# EAGLE design Engine Room (EAGLE 6.2)
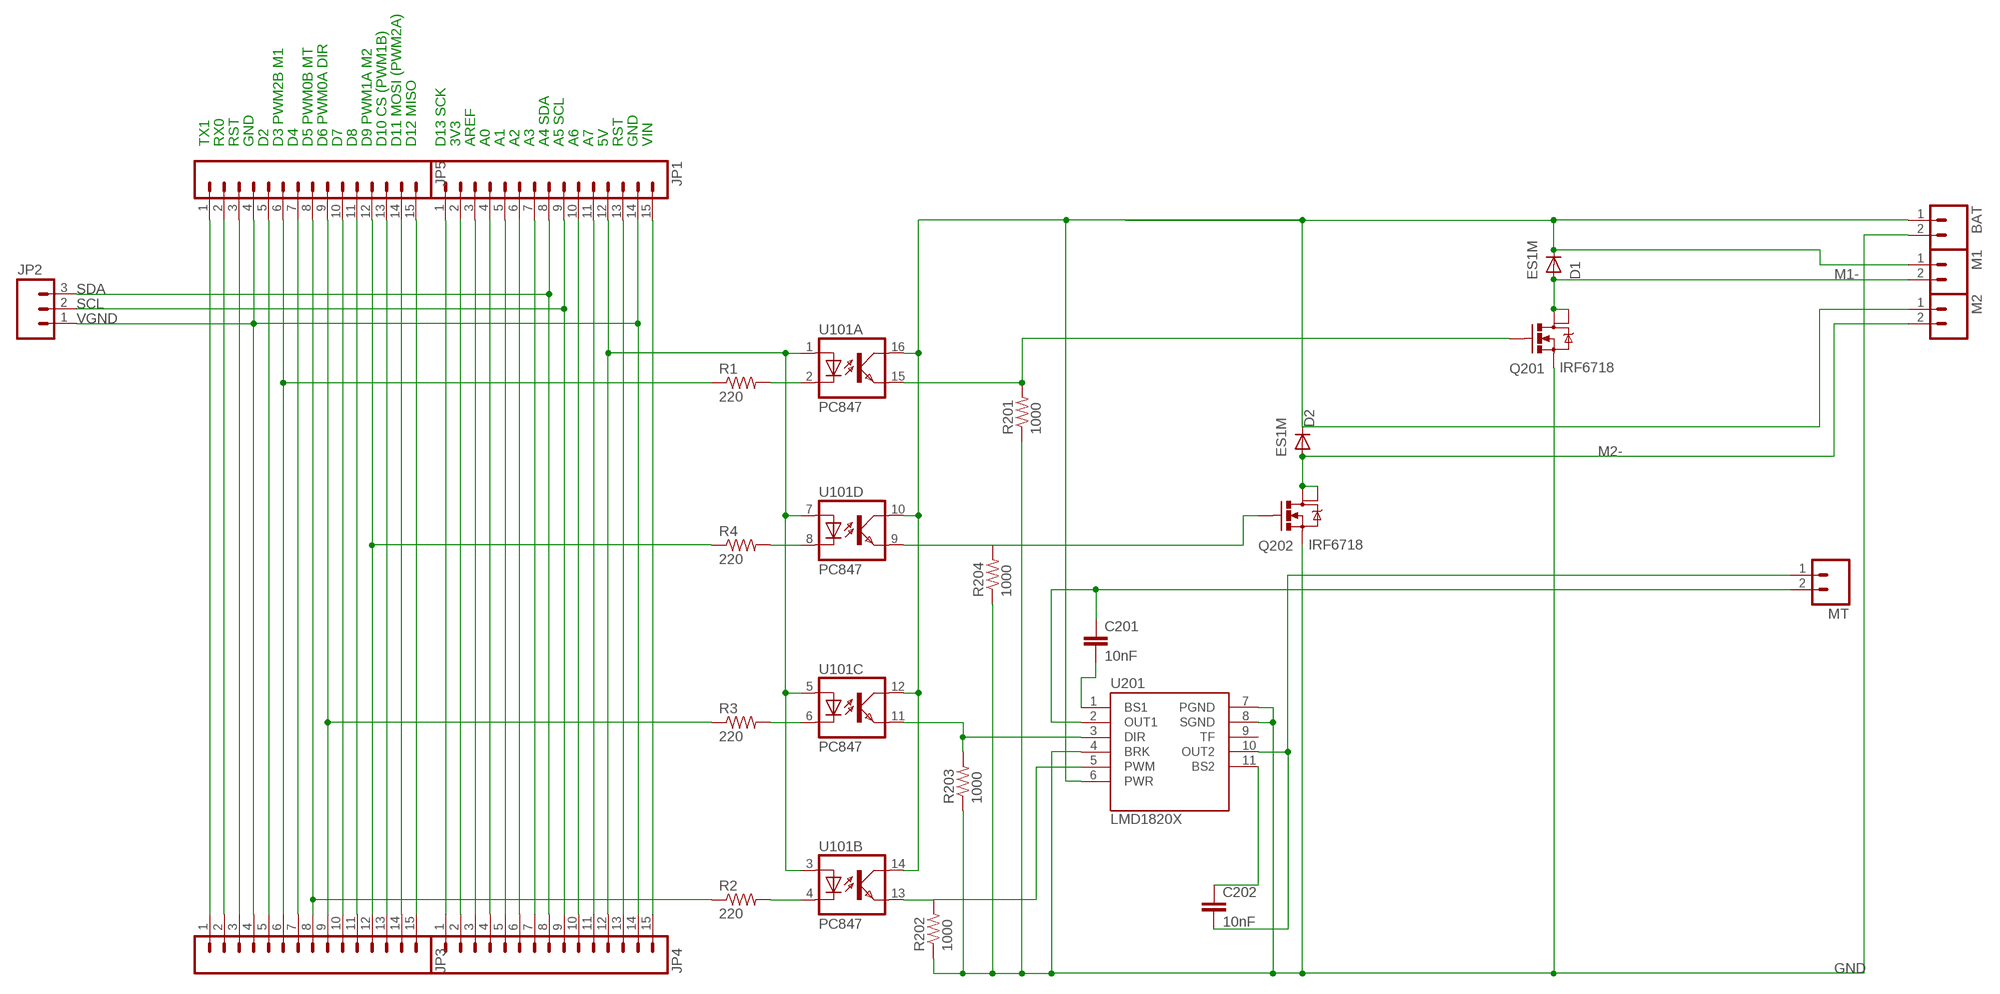
[diagram p0: schematic, sheet 1]

## Parts
BAT  M02PTH4  [1X02_XTRA_BIG]
C201  10nF  CAP0402-CAP  [0402-CAP]
C202  10nF  CAP0402-CAP  [0402-CAP]
D1  ES1M  DIODE-DO-214AC  [DO-214AC]
D2  ES1M  DIODE-DO-214AC  [DO-214AC]
JP1  M15LOCK  [1X15_LOCK]
JP2  M03LOCK  [1X03_LOCK]
JP3  M15  [1X15]
JP4  M15  [1X15]
JP5  M15LOCK  [1X15_LOCK]
M1  M02PTH4  [1X02_XTRA_BIG]
M2  M02PTH4  [1X02_XTRA_BIG]
MT  M02PTH  [1X02]
Q201  IRF6718  [DIRECTFET_L6]
Q202  IRF6718  [DIRECTFET_L6]
R1  220  RESISTOR0402-RES  [0402-RES]
R2  220  RESISTOR0402-RES  [0402-RES]
R3  220  RESISTOR0402-RES  [0402-RES]
R4  220  RESISTOR0402-RES  [0402-RES]
R201  1000  RESISTOR0402-RES  [0402-RES]
R202  1000  RESISTOR0402-RES  [0402-RES]
R203  1000  RESISTOR0402-RES  [0402-RES]
R204  1000  RESISTOR0402-RES  [0402-RES]
U101  PC847  [DIL16]
U201  LMD1820X  [TO-220-11LEAD]

## Nets
GND [power]: BAT.2 Q201.S Q202.S R201.1 R202.1 R203.1 R204.1 U201.4(BRK) U201.7(PGND) U201.8(SGND)
IN1: JP3.6 JP5.6 R1.1
IN2: JP3.12 JP5.12 R4.1
IN3: JP3.8 JP5.8 R2.1
M1- [power]: D1.A M1.2 Q201.D1 Q201.D2
M2- [power]: D2.A M2.2 Q202.D1 Q202.D2
N$1: R4.2 U101.8(D:C)
N$2: R3.2 U101.6(C:C)
N$3: R1.2 U101.2(A:C)
N$4: R2.2 U101.4(B:C)
N$5: JP1.15 JP4.15
N$6: Q201.G R201.2 U101.15(A:EMIT)
N$7: C202.1 U201.11(BS2)
N$8: Q202.G R204.2 U101.9(D:EMIT)
N$9: C201.2 U201.1(BS1)
N$10: R203.2 U101.11(C:EMIT) U201.3(DIR)
N$11: JP3.9 JP5.9 R3.1
N$12: JP3.1 JP5.1
N$13: JP3.2 JP5.2
N$14: JP3.3 JP5.3
N$15: R202.2 U101.13(B:EMIT) U201.5(PWM)
N$16 [lt_power]: C201.1 MT.2 U201.2(OUT1)
N$17 [lt_power]: C202.2 MT.1 U201.10(OUT2)
N$18: JP3.5 JP5.5
N$19: JP3.15 JP5.15
N$20: JP3.14 JP5.14
N$21: JP3.13 JP5.13
N$22: JP3.7 JP5.7
N$23: JP3.10 JP5.10
N$24: JP3.11 JP5.11
N$25: JP1.13 JP4.13
N$26: JP1.11 JP4.11
N$27: JP1.10 JP4.10
N$28: JP1.7 JP4.7
N$29: JP1.6 JP4.6
N$30: JP1.5 JP4.5
N$31: JP1.4 JP4.4
N$32: JP1.3 JP4.3
N$33: JP1.2 JP4.2
N$34: JP1.1 JP4.1
SCL: JP1.9 JP2.2 JP4.9
SDA: JP1.8 JP2.3 JP4.8
VCC: JP1.12 JP4.12 U101.1(A:A) U101.3(B:A) U101.5(C:A) U101.7(D:A)
VDD [power]: BAT.1 D1.C D2.C M1.1 M2.1 U101.10(D:COL) U101.12(C:COL) U101.14(B:COL) U101.16(A:COL) U201.6(PWR)
VGND: JP1.14 JP2.1 JP3.4 JP4.14 JP5.4
Unconnected: U201.9(TF)

## Notes on the sheet
- TX1 | RX0 | RST | GND | D2 | D3 PWM2B M1 | D4 | D5 PWM0B MT | D6 PWM0A DIR | D7 | D8 | D9 PWM1A M2 | D10 CS (PWM1B) | D11 MOSI (PWM2A) | D12 MISO | D13 SCK | 3V3 | AREF | A0 | A1 | A2 | A3 | A4 SDA | A5 SCL | A6 | A7 | 5V | RST | GND | VIN

## Library data of the parts
BAT M1 M2 MT = SparkFun:M02: Header 2 Standard 2-pin 0.1" header. Use with straight break away headers (SKU : PRT-00116), right angle break away headers (PRT-00553), swiss pins (PRT-00743), machine pins (PRT-00117), and female headers (PRT-00115). Molex polarized connector foot print use with SKU : PRT-08233 with associated crimp pins and housings.
C201 C202 = SparkFun:CAP: Capacitor Standard 0603 ceramic capacitor, and 0.1" leaded capacitor.
D1 D2 = diode:DIODE-: DIODE
JP1 JP3-JP5 = SparkFun:M15: Header 15 Standard 15-pin 0.1" header. Use with straight break away headers (SKU : PRT-00116), right angle break away headers (PRT-00553), swiss pins (PRT-00743), machine pins (PRT-00117), and female headers (PRT-00115).
JP2 = SparkFun:M03: Header 3 Standard 3-pin 0.1" header. Use with straight break away headers (SKU : PRT-00116), right angle break away headers (PRT-00553), swiss pins (PRT-00743), machine pins (PRT-00117), and female headers (PRT-00115). Molex polarized connector foot print use with SKU : PRT-08232 with associated crimp pins and housings.
Q201 Q202 = KwanSystems:IRF6718
R1-R4 R201-R204 = SparkFun:RESISTOR: Resistor Basic schematic elements and footprints for 0603, 1206, and PTH resistors.
U101 = optocoupler:PC847: SHARP OPTO COUPLER
U201 = SparkFun:LMD1820X: LMD1820X H-Bridge - BOB-00747

## Net classes
0 default: width 0.254 mm, clearance 0.254 mm
1 power: width 1.524 mm, clearance 0.254 mm
2 lt_power: width 0.254 mm, clearance 0.254 mm

## Board
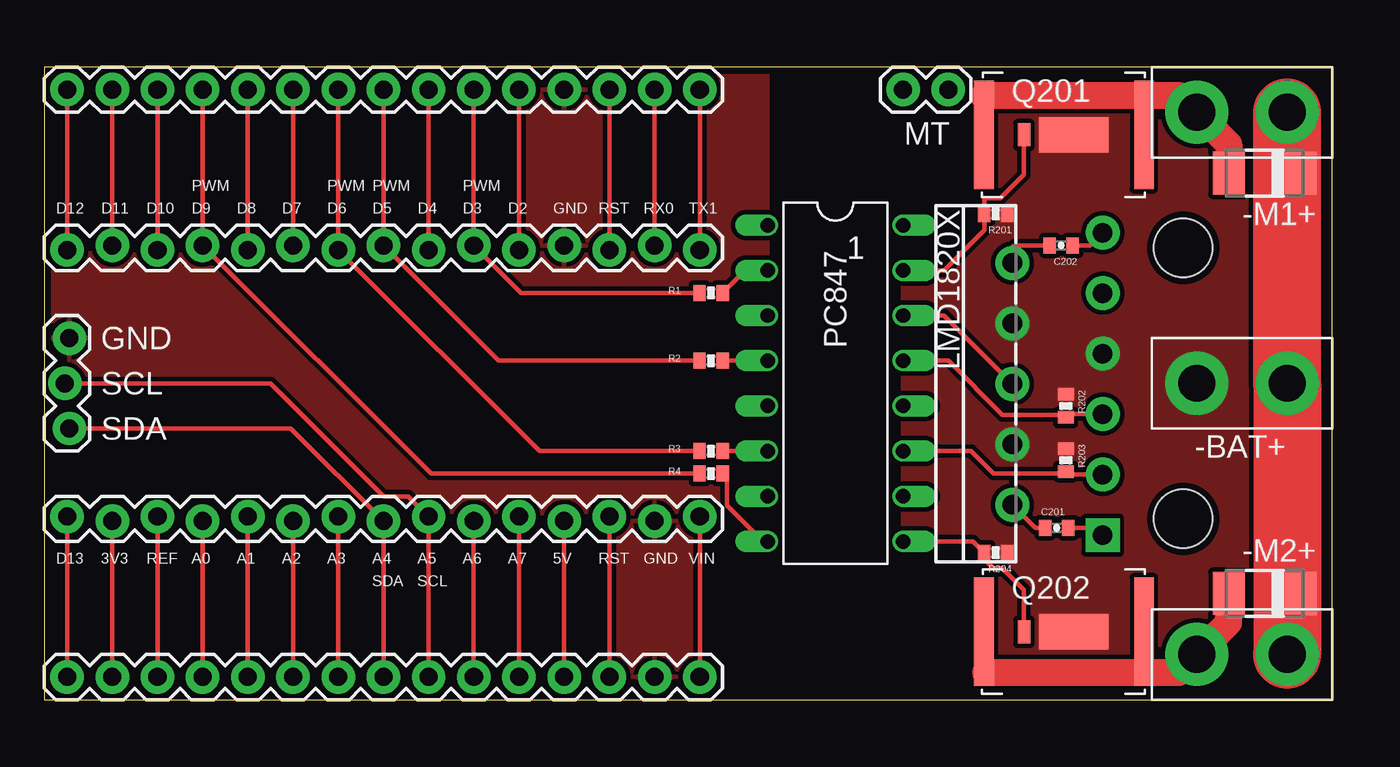
[diagram p1: board, top side]
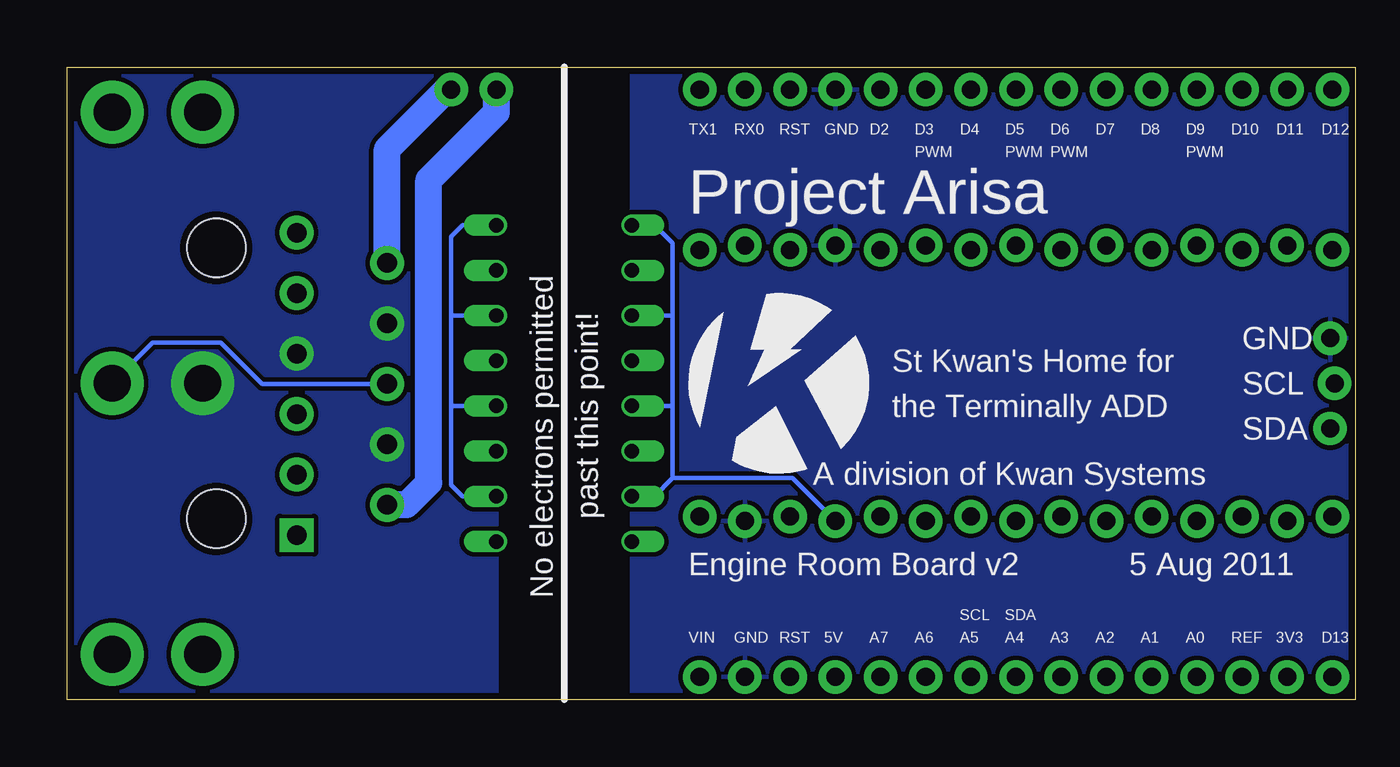
[diagram p2: board, bottom side, seen from below]

Size 72.39 x 35.56 mm. Coordinates in mm from the lower left corner, seen from the top.
Outline: 0,0 72.39,0 72.39,35.56 0,35.56 0,0
Copper layers (1*16): Top 0.0356mm / dielectric 1.5011mm / Bottom 0.0356mm
Design rules: minimum track width 6mil, minimum drill 13mil, track to track 6mil, track to pad 6mil, pad to pad 6mil, via to via 6mil, smd to smd 6mil, copper to edge 15mil, drill to drill 6mil, minimum pad ring 7mil, minimum via ring 7mil, stop-mask expansion 4mil, vias tented up to drill 0mil, thermal gap 10mil
tRestrict: area 41.9,0 to 47,35.6
bRestrict: area 41.9,0 to 47,35.6
vRestrict: area 29.8,15.2 to 34.9,20.3; area 0,26.7 to 38.1,33; area 7,15.9 to 26,19.7; area 2.5,12.1 to 30.5,13.3; area 0,2.5 to 38.1,8.9

### Footprints (pad centres in the part's own frame; a part is rotated, then mirrored left to right if it is on the bottom)
1X02_XTRA_BIG = drill 2.057 pad 3.556: 1 -2.54,0; 2 2.54,0
0402-CAP = smd 0.7 x 0.9: 1 -0.65,0; 2 0.65,0
DO-214AC = smd 1.8 x 2.4: A 2.025,0; C -2.025,0
1X15_LOCK = drill 1.016 pad 1.88: 1 0,0.127; 2 2.54,-0.127; 3 5.08,0.127; 4 7.62,-0.127; 5 10.16,0.127; 6 12.7,-0.127; 7 15.24,0.127; 8 17.78,-0.127; 9 20.32,0.127; 10 22.86,-0.127; 11 25.4,0.127; 12 27.94,-0.127; 13 30.48,0.127; 14 33.02,-0.127; 15 35.56,0.127
1X03_LOCK = drill 1.016 pad 1.88: 1 0,0.127; 2 2.54,-0.127; 3 5.08,0.127
1X15 = drill 1.016 pad 1.88: 1 0,0; 2 2.54,0; 3 5.08,0; 4 7.62,0; 5 10.16,0; 6 12.7,0; 7 15.24,0; 8 17.78,0; 9 20.32,0; 10 22.86,0; 11 25.4,0; 12 27.94,0; 13 30.48,0; 14 33.02,0; 15 35.56,0
1X02 = drill 1.016 pad 1.88: 1 0,0; 2 2.54,0
DIRECTFET_L6 = smd 1.1 x 6.1: D1 -4.35,0; D2 4.65,0 | smd 0.7 x 1.3: G -2.1,0 | smd 3.9 x 2: S 0.7,0
0402-RES = smd 0.7 x 0.9: 1 -0.65,0; 2 0.65,0
DIL16 = drill 0.813 offset: 1 -8.89,-3.81; 2 -6.35,-3.81; 3 -3.81,-3.81; 4 -1.27,-3.81; 5 1.27,-3.81; 6 3.81,-3.81; 7 6.35,-3.81; 8 8.89,-3.81; 9 8.89,3.81; 10 6.35,3.81; 11 3.81,3.81; 12 1.27,3.81; 13 -1.27,3.81; 14 -3.81,3.81; 15 -6.35,3.81; 16 -8.89,3.81
TO-220-11LEAD = drill 1.1 pad 1.9 square: 1 1.5,-4.87 | drill 1.1 pad 1.9: 2 3.2,0.21; 3 4.9,-4.87; 4 6.6,0.21; 5 8.3,-4.87; 6 10,0.21; 7 11.7,-4.87; 8 13.4,0.21; 9 15.1,-4.87; 10 16.8,0.21; 11 18.5,-4.87
STAND-OFF = hole 3.302: 0,0

### Placement (x,y rotation side)
BAT  67.31,17.78 180 top
C201  56.9,9.65 0 top
C202  57.15,25.53 180 top
D1  68.58,29.59 180 top
D2  68.58,5.97 180 top
JP1  1.27,10.16 0 top
JP2  1.27,20.32 270 top
JP3  36.83,34.29 180 top
JP4  1.27,1.27 0 top
JP5  36.83,25.4 180 top
M1  67.31,33.02 180 top
M2  67.31,2.54 180 top
MT  50.8,34.29 180 top
Q201  57.15,31.75 0 top
Q202  57.15,3.81 0 top
R1  37.47,22.86 0 top
R2  37.47,19.05 0 top
R3  37.47,13.97 0 top
R4  37.47,12.7 0 top
R201  53.47,27.3 180 top
R202  57.4,16.51 270 top
R203  57.4,13.46 270 top
R204  53.47,8.26 180 top
U101  44.45,17.78 270 top
U201  54.61,7.75 90 top
U$1  [STAND-OFF]  64.01,10.16 0 top
U$2  [STAND-OFF]  64.01,25.4 0 top
U$3  [KWAN_CIRCLE]  32.38,17.78 0 bottom

### Tracks (layer width: path | path; a pad name or v marks a point on that pad's centre or on a via)
GND
  pour Top (no thermals): 48.26,35.56 72.39,35.56 72.39,0 48.26,0
  pour Bottom (no thermals): 48.26,35.56 72.39,35.56 72.39,0 48.26,0
IN1
  Top 0.254: R1.1 26.8,22.86 JP5.6 JP3.6
IN2
  Top 0.254: JP3.12 JP5.12 21.72,12.7 R4.1
IN3
  Top 0.254: JP3.8 JP5.8 25.53,19.05 R2.1
M1-
  Top 0.254: 52.8,33.95 Q201.D1 | Q201.D2 61.72,31.75 61.72,33.95
  Top 1.524: D1.A 66.56,31.23 M1.2 63.84,33.95 61.72,33.95 52.8,33.95
M2-
  Top 0.406: Q202.D1 53.09,3.81 53.09,1.52 | Q202.D2 61.89,3.81 61.89,1.61
  Top 1.524: 61.98,1.52 63.75,1.52 M2.2 66.56,4.33 D2.A | 61.98,1.52 61.89,1.61 | 52.89,1.52 53.09,1.52 61.98,1.52
N$1
  Top 0.254: R4.2 38.35,12.46 38.35,10.92 40.39,8.89 U101.8
N$2
  Top 0.254: R3.2 U101.6
N$3
  Top 0.254: R1.2 39.38,24.13 U101.2
N$4
  Top 0.254: R2.2 U101.4
N$5
  Top 0.254: JP4.15 JP1.15
N$6
  Top 0.254: U101.15 50.55,24.13 52.82,26.4 R201.2 52.83,27.32 52.83,28.19 53.74,28.19 55.05,29.51 Q201.G
N$7
  Top 0.254: C202.1 58.76,25.53 U201.11
N$8
  Top 0.254: U101.9 52.18,8.89 R204.2 52.82,7.89 53.34,7.37 53.85,7.37 55.05,6.16 Q202.G
N$9
  Top 0.254: C201.2 59.08,9.65 U201.1
N$10
  Top 0.254: U201.3 57.57,12.65 R203.2 57.29,12.7 53.34,12.7 52.07,13.97 U101.11
N$11
  Top 0.254: JP3.9 JP5.9 27.81,13.97 R3.1
N$12
  Top 0.254: JP5.1 JP3.1
N$13
  Top 0.254: JP5.2 JP3.2
N$14
  Top 0.254: JP5.3 JP3.3
N$15
  Top 0.254: 58.83,16.05 U201.5 57.59,16.05 R202.2 57.26,16 53.85,16 50.8,19.05 U101.13
N$16
  Top 0.254: C201.1 55.7,9.65 U201.2
  Bottom 1.524: U201.2 53.31,10.95 52.07,12.19 52.07,29.21 48.26,33.02 MT.2
N$17
  Top 0.254: C202.2 54.53,25.53 54.4,25.4 U201.10
  Bottom 1.524: U201.10 54.4,30.94 51.05,34.29 MT.1
N$18
  Top 0.254: JP5.5 JP3.5
N$19
  Top 0.254: JP5.15 JP3.15
N$20
  Top 0.254: JP5.14 JP3.14
N$21
  Top 0.254: JP5.13 JP3.13
N$22
  Top 0.254: JP5.7 JP3.7
N$23
  Top 0.254: JP5.10 JP3.10
N$24
  Top 0.254: JP5.11 JP3.11
N$25
  Top 0.254: JP4.13 JP1.13
N$26
  Top 0.254: JP4.11 JP1.11
N$27
  Top 0.254: JP4.10 JP1.10
N$28
  Top 0.254: JP4.7 JP1.7
N$29
  Top 0.254: JP4.6 JP1.6
N$30
  Top 0.254: JP4.5 JP1.5
N$31
  Top 0.254: JP4.4 JP1.4
N$32
  Top 0.254: JP4.3 JP1.3
N$33
  Top 0.254: JP4.2 JP1.2
N$34
  Top 0.254: JP4.1 JP1.1
SCL
  Top 0.254: 21.59,1.02 JP4.9 JP1.9 20.45,11.43 19.05,11.43 12.7,17.78 JP2.2
SDA
  Top 0.254: JP4.8 JP1.8 13.84,15.24 13.72,15.24 12.95,15.24 JP2.3
VCC
  Top 0.254: JP4.12 JP1.12
  Bottom 0.254: U101.1 39.37,26.67 38.35,25.65 38.35,21.59 | 38.35,12.45 38.35,16.51 | 38.35,16.51 38.35,21.59 | 38.35,12.45 39.37,11.43 U101.7 | 38.35,16.51 U101.5 | JP1.12 31.62,12.45 38.35,12.45 | 38.35,21.59 U101.3
VDD
  Top 0.254: U201.6 50.56,21.59 U101.14
  Top 1.524: M2.1 arc-90 69.34,3.05 69.34,6.35 | 69.34,6.35 arc-90 69.33,6.36 | 69.46,29.72 69.85,29.72 69.98,29.59 D1.C | 69.34,6.35 69.72,5.97 D2.C
  Top 3.81: M1.1 69.85,29.72 BAT.1 M2.1
  Bottom 0.254: U101.16 50.16,26.67 50.8,26.04 50.8,21.59 | 50.8,16.51 50.8,12.06 50.16,11.43 U101.10 | 50.8,16.51 50.8,21.59 | 50.8,16.51 U101.12 | U201.6 61.44,17.75 63.75,20.07 67.56,20.07 BAT.1 | 50.8,21.59 U101.14
VGND
  pour Bottom: 0,35.56 0,0 40.64,0 40.64,35.56
  pour Top: 0,35.56 0,0 40.64,0 40.64,35.56

### Text on the board
tPlace: PWM | PWM | PWM | PWM | D12 | D11 | D10 | D9 | D8 | D7 | D6 | D5 | D4 | D3 | D2 | GND | RST | RX0 | TX1 | -M1+ | 1 | GND | SCL | SDA | -BAT+ | D13 | 3V3 | REF | A0 | A1 | A2 | A3 | A4 | A5 | A6 | A7 | 5V | RST | GND | VIN | -M2+ | SDA | SCL
bPlace: D12 | D11 | D10 | D9 | D8 | D7 | D6 | D5 | D4 | D3 | D2 | GND | RST | RX0 | TX1 | PWM | PWM | PWM | PWM | Project Arisa | GND | St Kwan's Home for | SCL | the Terminally ADD | SDA | A division of Kwan Systems | past this point! | 5 Aug 2011 | Engine Room Board v2 | No electrons permitted | SDA | SCL | D13 | 3V3 | REF | A0 | A1 | A2 | A3 | A4 | A5 | A6 | A7 | 5V | RST | GND | VIN